# EAGLE design MOTShield (EAGLE 9.6.2)
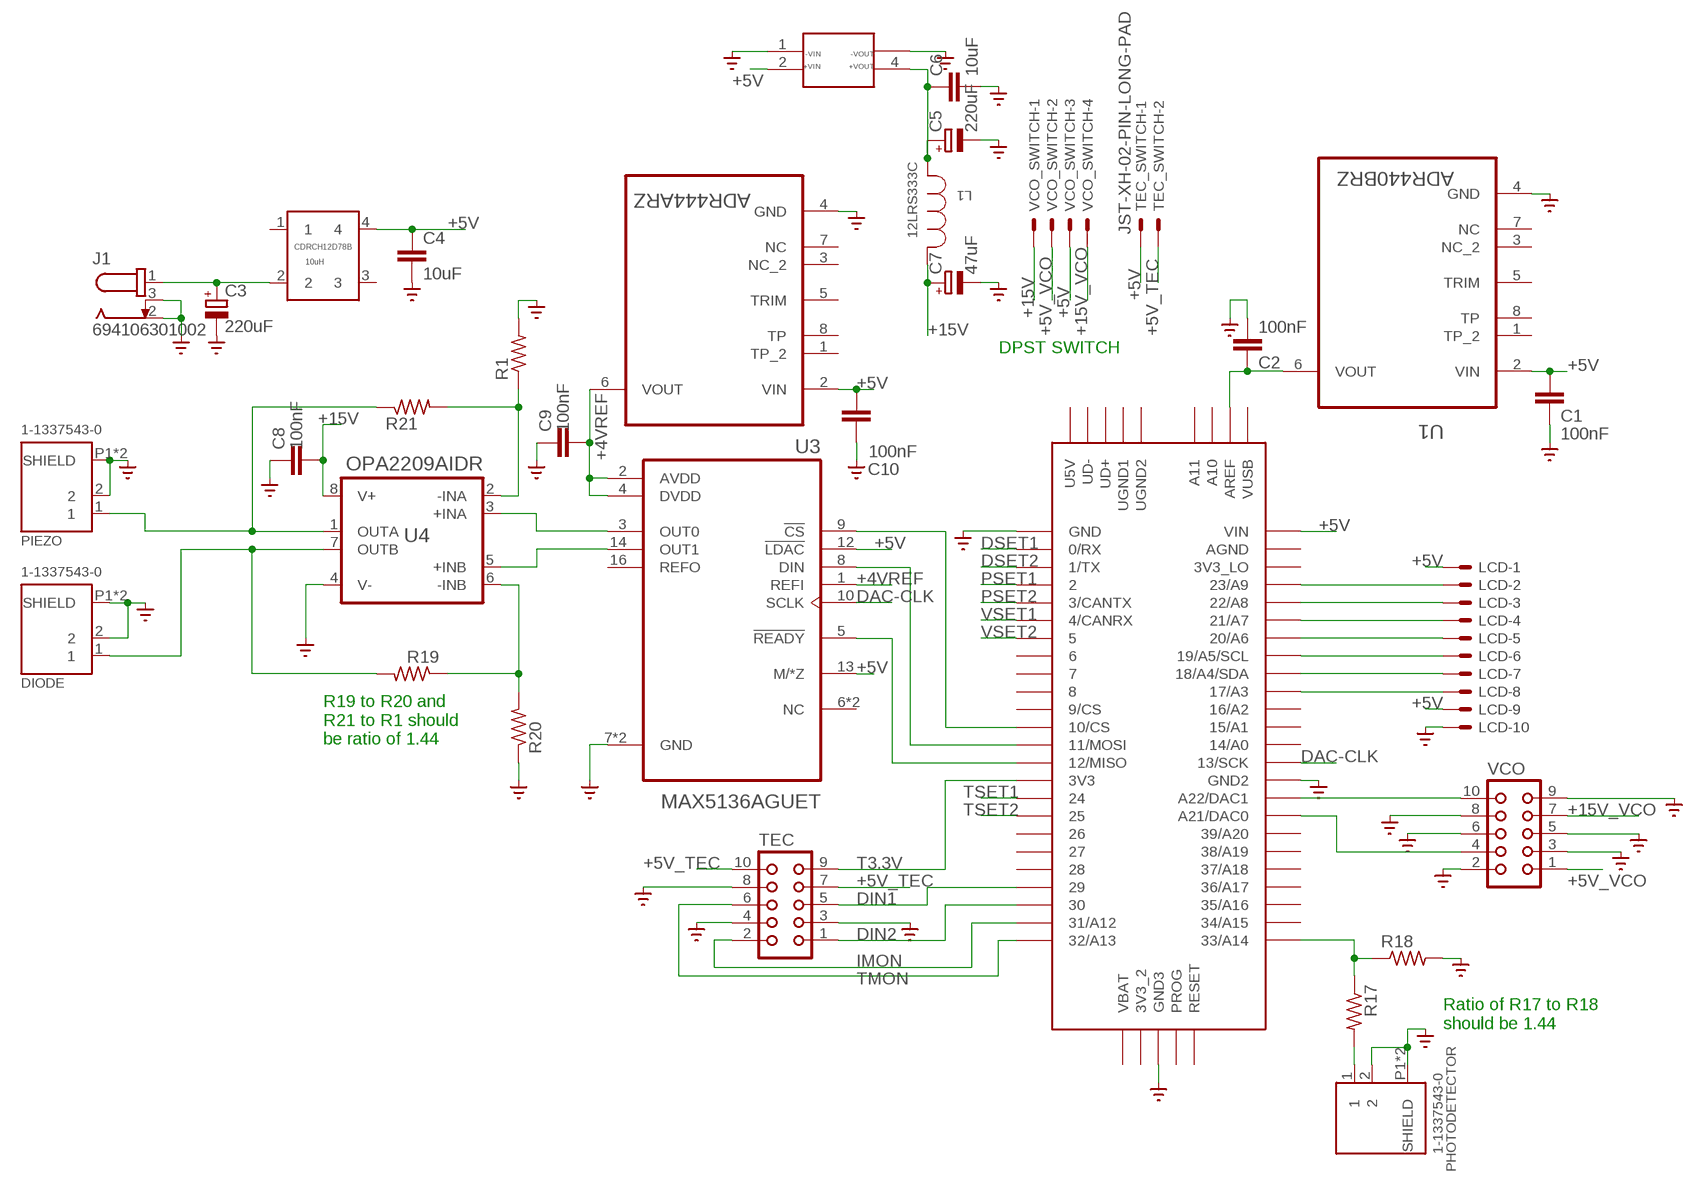
[diagram p0: schematic, sheet 1]

## Parts
ADR444ARZ  ADR440BRZ  [SOIC127P600X175-8N]
C1  100nF  C-EUC0603  [C0603]
C2  100nF  C-EUC0603  [C0603]
C3  220uF  CPOL-EUE3.5-8  [E3,5-8]
C4  10uF  C-EUC1206  [C1206]
C5  220uF  CPOL-EUE3.5-8  [E3,5-8]
C6  10uF  C-EUC1206  [C1206]
C7  47uF  CPOL-EU175TMP-0808  [175TMP-0808]
C8  100nF  C-EUC0603  [C0603]
C9  100nF  C-EUC0603  [C0603]
C10  100nF  C-EUC0603  [C0603]
DIODE  1-1337543-0  [CONN_1-1337543-0]
J1  694106301002  [694106301002]
L1  12LRS333C  [IND_MURATA_1200LRS_MUR]
LCD  JST-XH-10-PIN-LONG-PAD  [JST-XH-10-PACKAGE-LONG-PAD]
PHOTODETECTOR  1-1337543-0  [CONN_1-1337543-0]
PIEZO  1-1337543-0  [CONN_1-1337543-0]
R1  R-US_R1206  [R1206]
R17  R-US_R1206  [R1206]
R18  R-US_R1206  [R1206]
R19  R-US_R1206  [R1206]
R20  R-US_R1206  [R1206]
R21  R-US_R1206  [R1206]
TEC  CON10  [CON10]
TEC_SWITCH  JST-XH-02-PIN-LONG-PAD  [JST-XH-02-PACKAGE-LONG-PAD]
U1  ADR440BRZ  [SOIC127P600X175-8N]
U3  MAX5136AGUET  [SOP65P640X110-16N]
U4  OPA2209AIDR  [SOIC127P599X175-8N]
U$1  TEENSY_3.5/3.6  [TEENSY_3.5/3.6]
U$2  CRE1S0515SC  [SIP625W50P254L1173H771Q4]
U$3  10uH  CDRCH12D78BCDRCH12D78B  [INDDFN1220X1220X800-4N]
VCO  CON10  [CON10]
VCO_SWITCH  JST-XH-04-PIN-LONG-PAD  [JST-XH-04-PACKAGE-LONG-PAD]

## Nets
+4VREF: ADR444ARZ.6(VOUT) C9.2 U3.1(REFI) U3.2(AVDD) U3.4(DVDD)
+5V: ADR444ARZ.2(VIN) C1.2 C4.1 C10.2 LCD.1 LCD.9 TEC_SWITCH.1 U1.2(VIN) U3.12(!LDAC) U3.13(M/*Z) U$1.VIN U$2.2(+VIN) U$3.4 VCO_SWITCH.3
+5V_TEC: TEC.7 TEC.10 TEC_SWITCH.2
+5V_VCO: VCO.1 VCO_SWITCH.2
+15V: C7.+ C8.2 L1.1 U4.8(V+) VCO_SWITCH.1
+15V_VCO: VCO.7 VCO_SWITCH.4
DAC-CLK: U3.10(SCLK) U$1.13/SCK
DIN1: TEC.5 U$1.29
DIN2: TEC.1 U$1.30
DSET1: U$1.0/RX
DSET2: U$1.1/TX
GND: ADR444ARZ.4(GND) C1.1 C2.2 C3.- C4.2 C5.- C6.2 C7.- C8.1 C9.1 C10.1 DIODE.2 DIODE.P1(SHIELD) DIODE.P2(SHIELD) J1.2 J1.3 LCD.10 PHOTODETECTOR.2 PHOTODETECTOR.P1(SHIELD) PHOTODETECTOR.P2(SHIELD) PIEZO.2 PIEZO.P1(SHIELD) PIEZO.P2(SHIELD) R1.2 R18.2 R20.1 TEC.3 TEC.4 TEC.8 U1.4(GND) U3.7(GND) U3.15(GND) U4.4(V-) U$1.GND U$1.GND2 U$1.GND3 U$2.1(-VIN) U$2.3(-VOUT) VCO.2 VCO.3 VCO.5 VCO.6 VCO.8 VCO.9 ; supply symbol labelled SUPPLY0_GND_
IMON: TEC.2 U$1.31/A12
N$1: U3.3(OUT0) U4.3(+INA)
N$2: PHOTODETECTOR.1 R17.2
N$3: U$1.21/DAC0(A21/DAC0) VCO.4
N$4: C3.+ J1.1 U$3.2
N$5: LCD.2 U$1.23/A9
N$6: LCD.3 U$1.22/A8
N$7: LCD.4 U$1.21/A7
N$8: C5.+ C6.1 L1.3 U$2.4(+VOUT)
N$9: LCD.5 U$1.20/A6
N$10: LCD.6 U$1.19/A5/SCL
N$11: LCD.7 U$1.18/A4/SDA
N$12: LCD.8 U$1.17/A3
N$14: U$1.A22/DAC1 VCO.10
N$19: R17.1 R18.1 U$1.33/A14
N$20: U3.5(!READY) U$1.12/MISO
N$21: U3.8(DIN) U$1.11/MOSI
N$23: U3.9(!CS) U$1.10/CS
N$25: C2.1 U1.6(VOUT) U$1.AREF
N$29: U3.14(OUT1) U4.5(+INB)
N$31: R19.1 R20.2 U4.6(-INB)
N$32: PIEZO.1 R21.1 U4.1(OUTA)
N$34: R1.1 R21.2 U4.2(-INA)
N$35: DIODE.1 R19.2 U4.7(OUTB)
PSET1: U$1.2
PSET2: U$1.3/CANTX
T3.3V: TEC.9 U$1.3V3
TMON: TEC.6 U$1.32/A13
TSET1: U$1.24
TSET2: U$1.25
VSET1: U$1.4/CANRX
VSET2: U$1.5
Unconnected: ADR444ARZ.1(TP_2) ADR444ARZ.3(NC_2) ADR444ARZ.5(TRIM) ADR444ARZ.7(NC) ADR444ARZ.8(TP) U1.1(TP_2) U1.3(NC_2) U1.5(TRIM) U1.7(NC) U1.8(TP) U3.6(NC) U3.11(NC) U3.16(REFO) U$1.3V3_2 U$1.3V3_LO U$1.6 U$1.7 U$1.8 U$1.9/CS U$1.14/A0 U$1.15/A1 U$1.16/A2 U$1.26 U$1.27 U$1.28 U$1.34/A15 U$1.35/A16 U$1.36/A17 U$1.37/A18 U$1.38/A19 U$1.39/A20 U$1.A10 U$1.A11 U$1.AGND U$1.PROG U$1.RESET U$1.U5V U$1.UD+ U$1.UD- U$1.UGND1 U$1.UGND2 U$1.VBAT U$1.VUSB U$3.1 U$3.3

## Notes on the sheet
- DPST SWITCH
- R19 to R20 and
  R21 to R1 should 
  be ratio of 1.44
- Ratio of R17 to R18
  should be 1.44

## Library data of the parts
ADR444ARZ U1 = ADR440BRZ:ADR440BRZ: LDO XFET Voltage References; AVAILABILITY: Unavailable; DESCRIPTION: Series Voltage Reference IC ±0.05% 8-SOIC; MF: Analog Devices; MP: ADR440BRZ; PACKAGE: SOIC-8 Analog Devices; PRICE: None
C1 C2 C4 C6 C8-C10 = rcl:C-EU: CAPACITOR, European symbol; SPICEPREFIX: C
C3 C5 C7 = rcl:CPOL-EU: POLARIZED CAPACITOR, European symbol; SPICEPREFIX: C
DIODE PHOTODETECTOR PIEZO = 1-1337543-0:1-1337543-0: BNC appliance socket, right angle [TE Connectivity] 1-1337543-0 BNC appliance socket, right angle; DESCRIPTION: BNC Connector Jack, Female Socket 50Ohm Panel Mount, Through Hole, Right Angle Solder; DIGI-KEY_PART_NUMBER: A97553-ND; MF: TE Connectivity; MP: 113375430; PACKAGE: None
J1 = DC Power Jacks:694106301002: CONN PWR JACK 2.1X5.5MM SOLDER Manufacturer's datasheet <https://katalog.we-online.de/em/datasheet/6941xx301002.pdf>; CREATED_BY: PCBLayout.com; DIGIKEY_PART_NUMBER: 732-5930-ND; MANUFACTURER: Wurth Electronics Inc.; MPN: 694106301002
L1 = 12LRS333C:12LRS333C: MURATA 33uH 2.1A INDUCTOR; BUILT_BY: EMA_UL_Team; MANUFACTURER_PART_NUMBER: 12LRS333C; SOURCELIBRARY: Murata_2010-01-01IND_1200LRS; VENDOR: Murata
LCD = Rembrandt Electronics - JST XH Connectors v1-0:JST-XH-10-PIN: JST XH Connector 2 Pin Wire to board connector. Pitch: 2,54 mm, (0.100") Number of pins: 10 Created by Rembrandt Electronics www.rembrandtelectronics.com
R1 R17-R21 = rcl:R-US_: RESISTOR, American symbol; SPICEPREFIX: R
TEC VCO = con-harting:CON10: CONNECTOR; OC_FARNELL: unknown; OC_NEWARK: unknown
TEC_SWITCH = Rembrandt Electronics - JST XH Connectors v1-0:JST-XH-02-PIN: JST XH Connector 2 Pin Wire to board connector. Pitch: 2,54 mm, (0.100") Number of pins: 2 Created by Rembrandt Electronics www.rembrandtelectronics.com
U3 = MAX5136AGUET:MAX5136AGUET; DESCRIPTION: 16 Bit Digital to Analog Converter 2 16-TSSOP; DIGI-KEY_PART_NUMBER: MAX5136AGUE+T-ND; MF: Maxim Integrated; MP: MAX5136AGUE+; PACKAGE: TSSOP-16 Maxim; PURCHASE-URL: https://pricing.snapeda.com/search/part/MAX5136AGUE+/?ref=eda
U4 = OPA2209AIDR:OPA2209AIDR; DESCRIPTION: Dual, 2.2nV/rtHz, 18MHz, Precision, RRO, 36V Operational Amplifier 8-SOIC -40 to 125; DIGI-KEY_PART_NUMBER: 296-27783-1-ND; MF: Texas Instruments; MP: OPA2209AIDR; PACKAGE: SOIC-8 Texas Instruments; PURCHASE-URL: https://pricing.snapeda.com/search/part/OPA2209AIDR/?ref=eda
U$1 = Teensy356:TEENSY_3.5/3.6
U$2 = CRE1S0515SC:CRE1S0515SC
U$3 = CDRCH12D78B:CDRCH12D78B: SUMIDA POWER INDUCTOR
VCO_SWITCH = Rembrandt Electronics - JST XH Connectors v1-0:JST-XH-04-PIN: JST XH Connector 2 Pin Wire to board connector. Pitch: 2,54 mm, (0.100") Number of pins: 4 Created by Rembrandt Electronics www.rembrandtelectronics.com

## Board
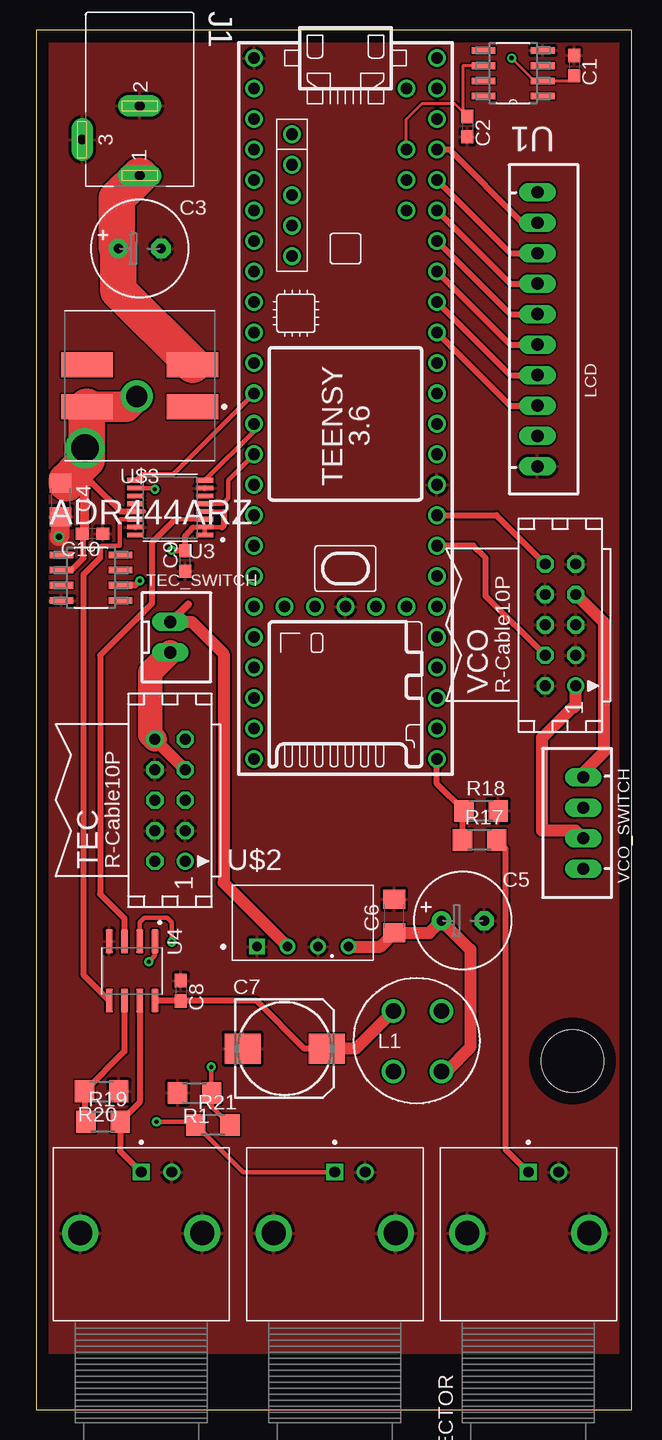
[diagram p1: board, top side]
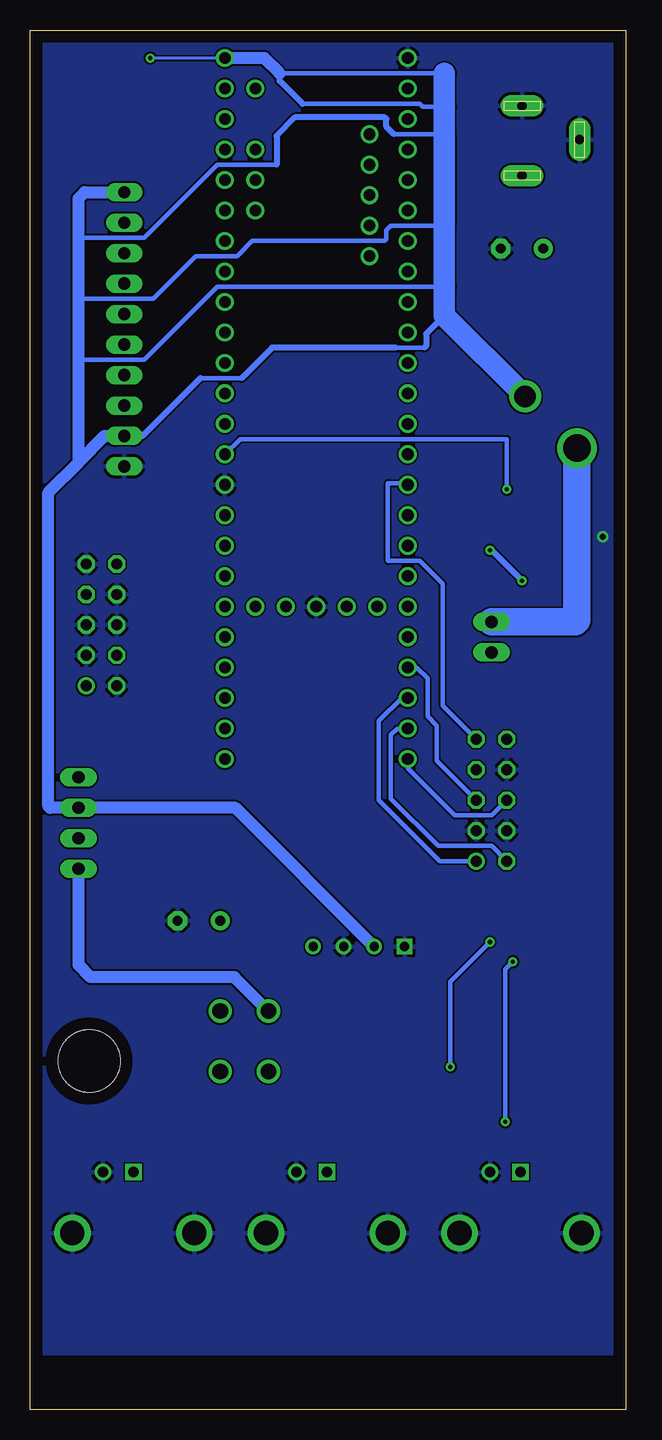
[diagram p2: board, bottom side, seen from below]

Size 49.64 x 114.99 mm. Coordinates in mm from the lower left corner, seen from the top.
Outline: 0,0 49.64,0 49.64,114.99 0,114.99 0,0
Copper layers (1*16): Top 0.035mm / dielectric 1.5mm / Bottom 0.035mm
Design rules "default": minimum track width 6mil, minimum drill 0.35mm, track to track 6mil, track to pad 6mil, pad to pad 6mil, via to via 6mil, smd to smd 6mil, copper to edge 40mil, drill to drill 6mil, minimum pad ring 10mil, minimum via ring 8mil, stop-mask expansion 4mil, vias tented up to drill 0mil, thermal gap 10mil
Holes 5.18 mm at 44.7,29.08

### Footprints (pad centres in the part's own frame; a part is rotated, then mirrored left to right if it is on the bottom)
SOIC127P600X175-8N = smd 1.981 x 0.559: 1 -2.464,1.905; 2 -2.464,0.635; 3 -2.464,-0.635; 4 -2.464,-1.905; 5 2.464,-1.905; 6 2.464,-0.635; 7 2.464,0.635; 8 2.464,1.905
C0603 = smd 1.1 x 1: 1 -0.85,0; 2 0.85,0
E3,5-8 = drill 0.813 pad 1.6: + -1.778,0 | drill 0.813 pad 1.6 octagon: - 1.778,0
C1206 = smd 1.6 x 1.8: 1 -1.4,0; 2 1.4,0
175TMP-0808 = smd 3 x 2.5: + 3.5,0; - -3.5,0
CONN_1-1337543-0 = drill 0.89 square: 1 0,0 | drill 0.89: 2 0,-2.54 | drill 2.01: P1 -5.08,-5.08; P2 -5.08,5.08
694106301002 = drill 0.8 pad 1.8 long: 1 13.6,0; 2 7.8,0; 3 10.6,-4.8
IND_MURATA_1200LRS_MUR = drill 1.295 pad 1.803: 1 -4.775,5.283; 2 -4.775,0.254; 3 -0.762,0.254; 4 -0.762,5.283
JST-XH-10-PACKAGE-LONG-PAD = drill 1.016 long: 1 -11.43,0; 2 -8.89,0; 3 -6.35,0; 4 -3.81,0; 5 -1.27,0; 6 1.27,0; 7 3.81,0; 8 6.35,0; 9 8.89,0; 10 11.43,0
R1206 = smd 1.6 x 1.803: 1 -1.422,0; 2 1.422,0
CON10 = drill 0.914: 1 -5.08,-1.27 | drill 0.914 octagon: 2 -5.08,1.27; 3 -2.54,-1.27; 4 -2.54,1.27; 5 0,-1.27; 6 0,1.27; 7 2.54,-1.27; 8 2.54,1.27; 9 5.08,-1.27; 10 5.08,1.27
JST-XH-02-PACKAGE-LONG-PAD = drill 1.016 long: 1 -1.27,0; 2 1.27,0
SOP65P640X110-16N = smd 1.5 x 0.41: 1 -2.885,2.275; 2 -2.885,1.625; 3 -2.885,0.975; 4 -2.885,0.325; 5 -2.885,-0.325; 6 -2.885,-0.975; 7 -2.885,-1.625; 8 -2.885,-2.275; 9 2.885,-2.275; 10 2.885,-1.625; 11 2.885,-0.975; 12 2.885,-0.325; 13 2.885,0.325; 14 2.885,0.975; 15 2.885,1.625; 16 2.885,2.275
SOIC127P599X175-8N = smd 1.97 x 0.6: 1 -2.47,1.905; 2 -2.47,0.635; 3 -2.47,-0.635; 4 -2.47,-1.905; 5 2.47,-1.905; 6 2.47,-0.635; 7 2.47,0.635; 8 2.47,1.905
TEENSY_3.5/3.6 = drill 0.965: 0/RX -25.4,-7.62; 1/TX -22.86,-7.62; 2 -20.32,-7.62; 3/CANTX -17.78,-7.62; 3V3 7.62,-7.62; 3V3_2 17.78,-2.54; 3V3_LO -22.86,7.62; 4/CANRX -15.24,-7.62; 5 -12.7,-7.62; 6 -10.16,-7.62; 7 -7.62,-7.62; 8 -5.08,-7.62; 9/CS -2.54,-7.62; 10/CS 0,-7.62; 11/MOSI 2.54,-7.62; 12/MISO 5.08,-7.62; 13/SCK 5.08,7.62; 14/A0 2.54,7.62; 15/A1 0,7.62; 16/A2 -2.54,7.62; 17/A3 -5.08,7.62; 18/A4/SDA -7.62,7.62; 19/A5/SCL -10.16,7.62; 20/A6 -12.7,7.62; 21/A7 -15.24,7.62; 21/DAC0 12.7,7.62; 22/A8 -17.78,7.62; 23/A9 -20.32,7.62; 24 10.16,-7.62; 25 12.7,-7.62; 26 15.24,-7.62; 27 17.78,-7.62; 28 20.32,-7.62; 29 22.86,-7.62; 30 25.4,-7.62; 31/A12 27.94,-7.62; 32/A13 30.48,-7.62; 33/A14 30.48,7.62; 34/A15 27.94,7.62; 35/A16 25.4,7.62; 36/A17 22.86,7.62; 37/A18 20.32,7.62; 38/A19 17.78,7.62; 39/A20 15.24,7.62; A10 -17.78,5.08; A11 -15.24,5.08; A22/DAC1 10.16,7.62; AGND -25.4,7.62; AREF -20.32,5.08; GND -27.94,-7.62; GND2 7.62,7.62; GND3 17.78,0; PROG 17.78,2.54; RESET 17.78,5.08; U5V -21.59,-4.445; UD+ -16.51,-4.445; UD- -19.05,-4.445; UGND1 -13.97,-4.445; UGND2 -11.43,-4.445; VBAT 17.78,-5.08; VIN -27.94,7.62; VUSB -25.4,5.08
SIP625W50P254L1173H771Q4 = drill 0.78 square: 1 0,0 | drill 0.78: 2 2.54,0; 3 5.08,0; 4 7.62,0
INDDFN1220X1220X800-4N = smd 4.312 x 2.112: 1 -4.4,1.75; 2 -4.4,-1.75; 3 4.4,-1.75; 4 4.4,1.75
JST-XH-04-PACKAGE-LONG-PAD = drill 1.016 long: 1 -3.81,0; 2 -1.27,0; 3 1.27,0; 4 3.81,0

### Placement (x,y rotation side)
ADR444ARZ  4.57,69.34 0 top
C1  44.83,112.01 270 top
C2  35.94,106.93 270 top
C3  8.64,96.77 0 top
C4  2.03,75.82 270 top
C5  35.56,40.77 0 top
C6  29.84,41.15 90 top
C7  20.7,30.1 0 top
C8  12.07,34.92 270 top
C9  12.45,70.74 90 top
C10  4.7,73.03 180 top
DIODE  8.76,19.81 90 top
J1  8.64,116.46 270 top
L1  34.54,27.94 0 top
LCD  41.78,90.04 270 top
PHOTODETECTOR  41.02,19.81 90 top
PIEZO  24.89,19.81 90 top
R1  13.21,26.42 180 top
R17  36.96,47.5 0 top
R18  37.08,49.91 0 top
R19  5.59,24 0 top
R20  5.46,26.54 180 top
R21  14.73,23.75 0 top
TEC  11.18,50.8 90 top
TEC_SWITCH  11.18,64.39 270 top
U1  39.75,111.38 180 top
U3  11.18,75.18 180 top
U4  8,36.58 270 top
U$1  25.78,84.71 270 top
U$2  18.41,38.61 0 top
U$3  8.64,85.34 180 top
VCO  43.69,65.41 90 top
VCO_SWITCH  45.59,48.9 90 top

### Tracks (layer width: path | path; a pad name or v marks a point on that pad's centre or on a via)
+4VREF  (via drill 0.35)
  Top 0.381: 15.49,73.53 15.47,73.56 U3.2 | U3.4 15.56,74.86 15.62,74.8 | 13.07,73.53 13.09,73.56 U3.2 | U3.2 U3.1
  Top 0.508: 15.62,74.8 15.62,73.66 15.49,73.53 | 13.07,73.53 12.45,72.85 C9.2 12.41,71.63 v11.3,71.63 | ADR444ARZ.6 8.25,68.71 v8.64,69.09
  Bottom 0.508: v8.64,69.09 11.18,71.63 v11.3,71.63
+5V  (via drill 0.35, 1.78, 2.29)
  Top 0.254: v39.62,112.65 41.53,110.74 U1.2 44.41,110.74 C1.2
  Top 0.381: 9.03,74.88 8.32,74.88 U3.13 | 2.92,69.98 2.94,69.98 | C10.2 3.94,72.94 3.94,72.9 4.24,73.2 4.24,79.17 | 3.94,70.98 3.92,70.98 2.92,69.98 | ADR444ARZ.2 2.92,69.98 | 2.54,77.47 2.29,77.47 C4.1
  Top 0.508: C4.1 4.7,77.22 7.05,74.87 8.3,74.87 8.32,74.88 | U3.13 U3.12 | 3.17,78.11 3.94,77.34 3.94,72.9 3.94,70.98 2.94,69.98
  Top 0.635: TEC_SWITCH.1 12.66,67.14
  Top 1.016: TEC_SWITCH.1 12.95,65.66 15.62,62.99 15.62,43.94 U$2.2
  Top 2.54: U$3.4 7.52,83.59 v8.38,84.45
  Top 3.048: U$3.4 4.24,80.14 | 4.24,80.14 4.24,79.17 3.17,78.11 2.54,77.47 2.54,77.22 | 4.24,80.14 v4.06,80.14
  Bottom 0.254: U$1.VIN 33.66,112.65 v39.62,112.65
  Bottom 0.381: 15.11,111.38 28.83,111.38 | 15.11,108.58 16.89,108.58 17.14,108.84 26.92,108.84 | 15.37,106.3 19.3,106.3 | 45.58,97.66 40.13,97.66 34.04,103.76 29.08,103.76 | 45.58,87.5 40.13,87.5 34.04,93.6 15.11,93.6 | 16.76,88.52 19.18,88.52 | 32,85.98 35.43,85.98 | 15.11,98.93 15.37,98.68 19.56,98.68 19.94,98.3 19.94,97.54 20.07,97.41 31.12,97.41 32.38,96.14 35.81,96.14 39.37,92.58 45.58,92.58
  Bottom 0.508: 30.1,112.65 U$1.VIN | 26.92,108.84 28.83,110.74 28.83,111.38 | 15.11,106.05 15.37,106.3 | 19.3,106.3 19.94,106.93 19.94,107.57 20.07,107.7 27.56,107.7 29.08,106.17 29.08,103.76 | 15.11,91.19 16.64,89.66 16.64,88.65 16.76,88.52 | 32,85.98 29.46,88.52 19.18,88.52 | 35.43,85.98 40.26,81.15 LCD.9
  Bottom 1.016: U$2.2 32.51,50.16 VCO_SWITCH.3 47.99,50.16 48.11,50.29 48.11,76.45 45.58,78.98 | 45.58,78.98 43.41,81.15 LCD.9 | 45.58,78.98 45.58,87.5 45.58,92.58 45.58,97.66 45.58,100.95 45.59,100.97 45.09,101.47 LCD.1 | 28.83,111.38 30.1,112.65 33.66,112.65
  Bottom 1.778: v8.38,84.45 15.11,91.19 15.11,93.6 15.11,98.93 15.11,106.05 15.11,108.58 15.11,111.38
  Bottom 2.286: v4.06,80.14 4.06,65.79 4.19,65.66 TEC_SWITCH.1
+5V_TEC
  Top 1.016: TEC.10 TEC.7
  Top 2.032: TEC_SWITCH.2 9.52,61.47 9.52,56.26 TEC.10
+5V_VCO
  Top 1.016: VCO_SWITCH.2 44.96,48.26 42.16,48.26 42.16,56.01 44.7,58.55 44.83,58.55 44.96,58.67 VCO.1
+15V
  Top 0.508: C7.+ 22.35,30.1 18.38,34.08 C8.2 9.94,34.08 U4.8
  Top 1.016: L1.1 26.64,30.1 C7.+
  Bottom 1.016: L1.1 32.61,36.07 44.58,36.07 45.59,37.08 VCO_SWITCH.1
+15V_VCO
  Top 1.016: VCO_SWITCH.4 45.59,53.09 47.35,54.84 47.35,65.51 47.37,65.53 VCO.7
DAC-CLK  (via drill 0.33)
  Top 0.381: U3.10 9.8,76.81 v9.91,76.71
  Bottom 0.381: v9.91,76.71 9.91,80.9 32.13,80.9 U$1.13/SCK
DIN1
  Bottom 0.381: TEC.5 15.75,54.1 15.75,57.02 16.51,57.78 16.51,60.96 17.4,61.85 U$1.29
DIN2
  Bottom 0.381: TEC.1 15.49,45.72 20.57,50.8 20.57,57.4 18.67,59.31 U$1.30
GND  (via drill 0.51)
  Top 1.524: C4.2 2.03,72.9 v1.9,72.77
  pour Bottom: 49.66,114.67 49.66,4.7 0,4.7 0,114.54
  pour Top: 0.08,114.55 50.16,114.55 50.16,4.99 50.45,4.7 -0.58,4.7
IMON
  Bottom 0.381: TEC.2 11.18,46.99 15.62,46.99 19.56,50.93 19.56,56.26 19.05,56.77 U$1.31/A12
N$1
  Top 0.381: 11.6,74.21 U3.3
  Top 0.508: 11.6,74.21 9.65,72.26 9.65,67.18 5.33,62.87 5.33,42.98 7.37,40.95 U4.3
N$2
  Top 0.508: PHOTODETECTOR.1 39.12,21.72 39.12,46.76 R17.2
N$3
  Top 0.508: VCO.4 37.46,67.82 37.46,70.99 36.45,72.01 U$1.21/DAC0
N$4
  Top 3.048: J1.1 6.73,100.95 6.73,96.9 C3.+ 6.86,93.27 U$3.2
N$5
  Top 0.508: U$1.23/A9 34.42,105.03 40.51,98.93 LCD.2
N$6
  Top 0.508: U$1.22/A8 39.5,96.39 LCD.3
N$7
  Top 0.508: U$1.21/A7 39.5,93.85 LCD.4
N$8
  Top 1.016: U$2.4 28.7,38.61 C6.1 32.76,39.75 C5.+ 36.2,38.35 36.2,30.23 34.16,28.19 L1.3
N$9
  Top 0.508: U$1.20/A6 39.5,91.31 LCD.5
N$10
  Top 0.508: U$1.19/A5/SCL 39.5,88.77 LCD.6
N$11
  Top 0.508: U$1.18/A4/SDA 39.5,86.23 LCD.7
N$12
  Top 0.508: U$1.17/A3 39.5,83.69 LCD.8
N$14
  Top 0.508: U$1.A22/DAC1 38.35,74.55 VCO.10
N$19
  Top 0.508: R17.1 35.53,49.78 R18.1 33.4,52.17 U$1.33/A14
N$20
  Top 0.381: U3.5 15.56,75.51 16,75.95 16,77.47 U$1.12/MISO
N$21
  Top 0.381: U3.8 18.16,81.56 U$1.11/MOSI
N$23
  Top 0.381: U3.9 8.81,77.98 11.43,77.98 U$1.10/CS
N$25
  Top 0.254: U1.6 35.56,112.01 35.56,108.17 C2.1 34.89,108.84 32.13,108.84 30.86,107.57 U$1.AREF
N$29
  Top 0.381: 7.66,74.21 U3.14 7.03,74.21 6.99,74.17 6.99,72.01 5.46,72.01 5.33,71.88
  Top 0.508: U4.5 3.94,36.27 3.94,69.6 5.33,70.99 5.33,71.88
N$31
  Top 0.508: U4.6 7.37,29.87 R20.2 4.04,24.13 R19.1
N$32  (via drill 0.35)
  Top 0.381: v10.03,24 13.06,24 R21.1 17.25,19.81 PIEZO.1 | U4.1 9.91,37.85 v9.4,37.34
  Bottom 0.381: v9.4,37.34 10.03,36.7 v10.03,24
N$34  (via drill 0.35)
  Top 0.381: R21.2 14.63,25.27 R1.1 14.61,26.44 v14.61,28.57 | U4.2 8.64,40.64 9.02,41.02 10.92,41.02 11.3,40.64 v11.3,38.99
  Bottom 0.381: v11.3,38.99 14.61,35.69 v14.61,28.57
N$35
  Top 0.508: U4.7 8.64,25.63 R19.2 7.01,21.56 DIODE.1
T3.3V
  Bottom 0.381: TEC.9 15.24,58.67 15.24,68.83 17.14,70.74 19.81,70.74 19.81,77.22 18.29,77.22 U$1.3V3
TMON
  Bottom 0.381: TEC.6 11.18,49.53 14.22,49.53 18.16,53.47 U$1.32/A13